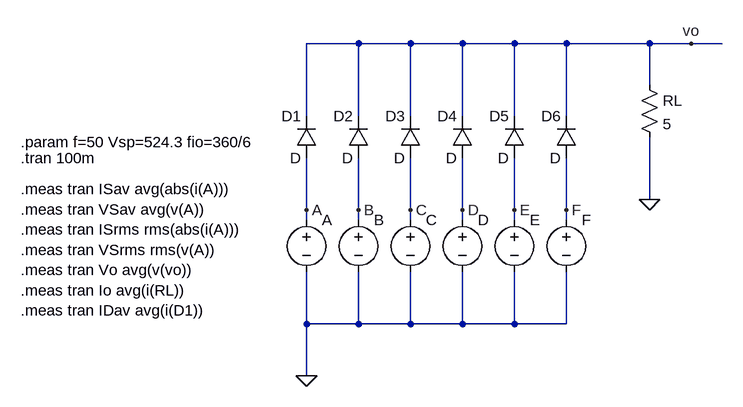
[diagram p0: schematic rectifHexafasico.asc]
rectifHexafasico.asc, the LTspice schematic file:
Version 4
SHEET 1 880 872
WIRE -1008 32 -1088 32
WIRE -928 32 -1008 32
WIRE -848 32 -928 32
WIRE -768 32 -848 32
WIRE -688 32 -768 32
WIRE -560 32 -688 32
WIRE -496 32 -560 32
WIRE -448 32 -496 32
WIRE -560 96 -560 32
WIRE -1088 144 -1088 32
WIRE -1008 144 -1008 32
WIRE -928 144 -928 32
WIRE -848 144 -848 32
WIRE -768 144 -768 32
WIRE -688 144 -688 32
WIRE -560 272 -560 176
WIRE -1088 288 -1088 208
WIRE -1008 288 -1008 208
WIRE -928 288 -928 208
WIRE -848 288 -848 208
WIRE -768 288 -768 208
WIRE -688 288 -688 208
WIRE -1088 304 -1088 288
WIRE -1008 304 -1008 288
WIRE -928 304 -928 288
WIRE -848 304 -848 288
WIRE -768 304 -768 288
WIRE -688 304 -688 288
WIRE -1088 464 -1088 384
WIRE -1008 464 -1008 384
WIRE -1008 464 -1088 464
WIRE -928 464 -928 384
WIRE -928 464 -1008 464
WIRE -848 464 -848 384
WIRE -848 464 -928 464
WIRE -768 464 -768 384
WIRE -768 464 -848 464
WIRE -688 464 -688 384
WIRE -688 464 -768 464
WIRE -1088 544 -1088 464
FLAG -1088 544 0
FLAG -560 272 0
FLAG -496 32 vo
FLAG -1088 288 A
FLAG -1008 288 B
FLAG -928 288 C
FLAG -848 288 D
FLAG -768 288 E
FLAG -688 288 F
SYMBOL voltage -1088 288 R0
WINDOW 3 317 96 Invisible 2
WINDOW 123 0 0 Left 0
WINDOW 39 0 0 Left 0
SYMATTR Value SINE(0 {Vsp} {f} 0 0 0)
SYMATTR InstName A
SYMBOL voltage -1008 288 R0
WINDOW 3 24 96 Invisible 2
WINDOW 123 0 0 Left 0
WINDOW 39 0 0 Left 0
SYMATTR Value SINE(0 {Vsp} {f} 0 0 {fio})
SYMATTR InstName B
SYMBOL voltage -928 288 R0
WINDOW 3 24 96 Invisible 2
WINDOW 123 0 0 Left 0
WINDOW 39 0 0 Left 0
SYMATTR Value SINE(0 {Vsp} {f} 0 0 {2*fio})
SYMATTR InstName C
SYMBOL voltage -848 288 R0
WINDOW 3 24 96 Invisible 2
WINDOW 123 0 0 Left 0
WINDOW 39 0 0 Left 0
SYMATTR Value SINE(0 {Vsp} {f} 0 0 {3*fio})
SYMATTR InstName D
SYMBOL voltage -768 288 R0
WINDOW 3 24 96 Invisible 2
WINDOW 123 0 0 Left 0
WINDOW 39 0 0 Left 0
SYMATTR Value SINE(0 {Vsp} {f} 0 0 {-2*fio})
SYMATTR InstName E
SYMBOL voltage -688 288 R0
WINDOW 3 24 96 Invisible 2
WINDOW 123 0 0 Left 0
WINDOW 39 0 0 Left 0
SYMATTR Value SINE(0 {Vsp} {f} 0 0 {-fio})
SYMATTR InstName F
SYMBOL diode -1072 208 R180
WINDOW 0 24 64 Left 2
WINDOW 3 24 0 Left 2
SYMATTR InstName D1
SYMBOL diode -992 208 R180
WINDOW 0 24 64 Left 2
WINDOW 3 24 0 Left 2
SYMATTR InstName D2
SYMBOL diode -912 208 R180
WINDOW 0 24 64 Left 2
WINDOW 3 24 0 Left 2
SYMATTR InstName D3
SYMBOL diode -832 208 R180
WINDOW 0 24 64 Left 2
WINDOW 3 24 0 Left 2
SYMATTR InstName D4
SYMBOL diode -752 208 R180
WINDOW 0 24 64 Left 2
WINDOW 3 24 0 Left 2
SYMATTR InstName D5
SYMBOL diode -672 208 R180
WINDOW 0 24 64 Left 2
WINDOW 3 24 0 Left 2
SYMATTR InstName D6
SYMBOL res -576 80 R0
SYMATTR InstName RL
SYMATTR Value 5
TEXT -1528 184 Left 2 !.param f=50 Vsp=524.3 fio=360/6
TEXT -1528 208 Left 2 !.tran 100m
TEXT -1528 256 Left 2 !.meas tran ISav avg(abs(i(A)))\n.meas tran VSav avg(v(A))\n.meas tran ISrms rms(abs(i(A)))\n.meas tran VSrms rms(v(A))\n.meas tran Vo avg(v(vo))\n.meas tran Io avg(i(RL))\n.meas tran IDav avg(i(D1))

The netlist it stands for:
* rectifHexafasico.asc
V§A A 0 SINE(0 {Vsp} {f} 0 0 0)
V§B B 0 SINE(0 {Vsp} {f} 0 0 {fio})
V§C C 0 SINE(0 {Vsp} {f} 0 0 {2*fio})
V§D D 0 SINE(0 {Vsp} {f} 0 0 {3*fio})
V§E E 0 SINE(0 {Vsp} {f} 0 0 {-2*fio})
V§F F 0 SINE(0 {Vsp} {f} 0 0 {-fio})
D1 A vo D
D2 B vo D
D3 C vo D
D4 D vo D
D5 E vo D
D6 F vo D
RL vo 0 5
.model D D
.lib standard.dio
.param f=50 Vsp=524.3 fio=360/6
.tran 100m
.meas tran ISav avg(abs(i(A)))
.meas tran VSav avg(v(A))
.meas tran ISrms rms(abs(i(A)))
.meas tran VSrms rms(v(A))
.meas tran Vo avg(v(vo))
.meas tran Io avg(i(RL))
.meas tran IDav avg(i(D1))
.backanno
.end

* Results of the author's LTspice run, read from the files saved beside the schematic
* Operating Point, zero values left out:
*   V(b) = 433.6 V
*   V(c) = 433.6 V
*   V(e) = -433.6 V
*   V(f) = -433.6 V
*   V(vo) = 432.7 V
*   I(D6) = -866.3 pA
*   I(D5) = -866.3 pA
*   I(D4) = -432.7 pA
*   I(D3) = 43.27 A
*   I(D2) = 43.27 A
*   I(D1) = -432.7 pA
*   I(Rl) = 86.54 A
*   I(F) = 866.3 pA
*   I(E) = 866.3 pA
*   I(D) = 432.7 pA
*   I(C) = -43.27 A
*   I(B) = -43.27 A
*   I(A) = 432.7 pA
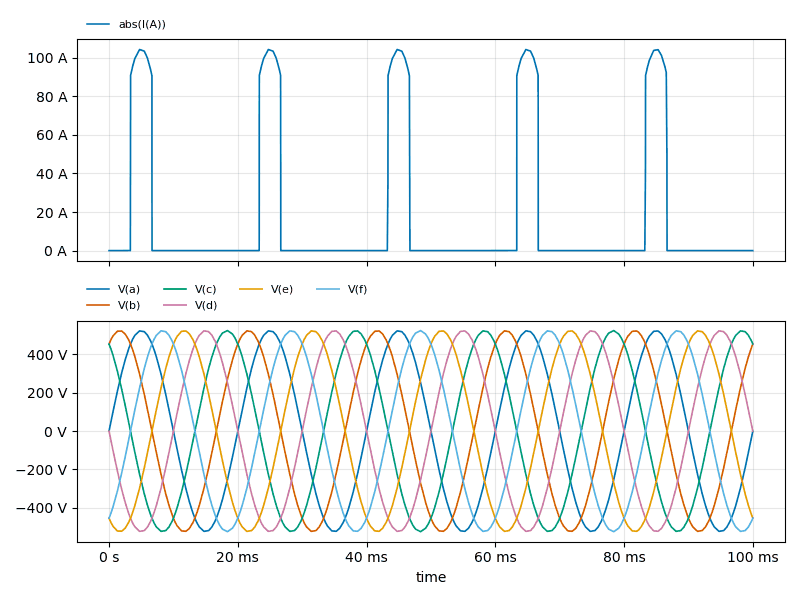
[diagram p1: Transient Analysis of rectifHexafasico.asc, plotted from the saved traces]
* Transient Analysis, 1 run:
*   abs(I(A)): min 0 A, max 104.3 A, average 16.64 A, rms 40.69 A, last 0 A
*   V(a): min -522.7 V, max 522.7 V, average -766.5 µV, rms 370.7 V, last 0 V
*   V(b): min -522.6 V, max 522.6 V, average 409.1 µV, rms 370.8 V, last 454.1 V
*   V(c): min -524.2 V, max 524.2 V, average 1.176 mV, rms 370.7 V, last 454.1 V
*   V(d): min -522.7 V, max 522.7 V, average 766.5 µV, rms 370.7 V, last 0 V
*   V(e): min -522.6 V, max 522.6 V, average -409.1 µV, rms 370.8 V, last -454.1 V
*   V(f): min -524.2 V, max 524.2 V, average -1.176 mV, rms 370.7 V, last -454.1 V
* From the log:
*   isav: AVG(abs(i(a)))=16.6885 FROM 0 TO 0.1
*   vsav: AVG(v(a))=-0.000403563 FROM 0 TO 0.1
*   isrms: RMS(abs(i(a)))=40.7865 FROM 0 TO 0.1
*   vsrms: RMS(v(a))=370.72 FROM 0 TO 0.1
*   vo: AVG(v(vo))=499.6 FROM 0 TO 0.1
*   io: AVG(i(rl))=99.9201 FROM 0 TO 0.1
*   idav: AVG(i(d1))=16.6885 FROM 0 TO 0.1